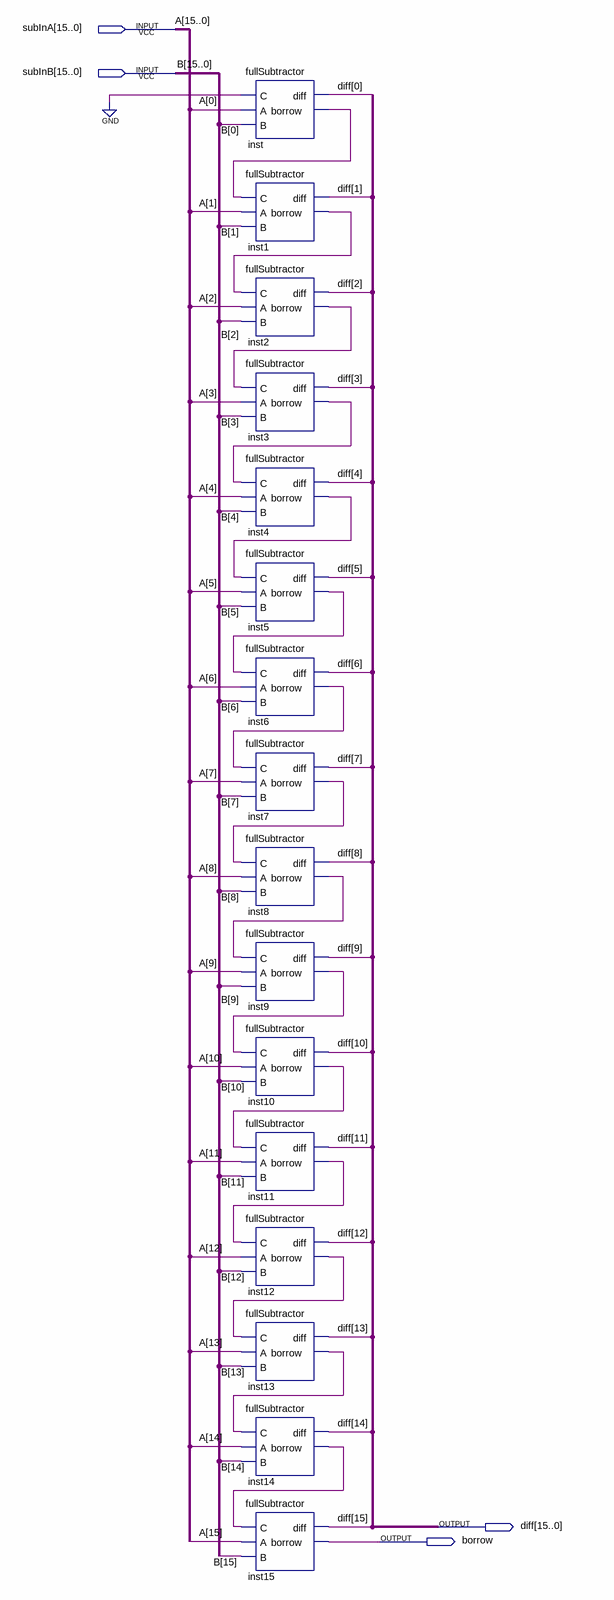
[diagram p0: schematic sheet]
// Quartus schematic sub16.bdf as structural Verilog: 16 symbols, 4 pins
module sub16 (
  input  [15:0] subInA,
  input  [15:0] subInB,
  output [15:0] diff,
  output borrow
);

  wire inst1_borrow, inst2_borrow, inst3_borrow, inst4_borrow, inst5_borrow, inst6_borrow, inst7_borrow,
       inst8_borrow, inst9_borrow, inst10_borrow, inst11_borrow, inst12_borrow, inst13_borrow, inst14_borrow,
       inst_borrow;

  fullSubtractor inst (.C(1'b0), .A(subInA[0]), .B(subInB[0]), .diff(diff[0]), .borrow(inst_borrow));
  fullSubtractor inst1 (.C(inst_borrow), .A(subInA[1]), .B(subInB[1]), .diff(diff[1]), .borrow(inst1_borrow));
  fullSubtractor inst2 (.C(inst1_borrow), .A(subInA[2]), .B(subInB[2]), .diff(diff[2]), .borrow(inst2_borrow));
  fullSubtractor inst3 (.C(inst2_borrow), .A(subInA[3]), .B(subInB[3]), .diff(diff[3]), .borrow(inst3_borrow));
  fullSubtractor inst4 (.C(inst3_borrow), .A(subInA[4]), .B(subInB[4]), .diff(diff[4]), .borrow(inst4_borrow));
  fullSubtractor inst5 (.C(inst4_borrow), .A(subInA[5]), .B(subInB[5]), .diff(diff[5]), .borrow(inst5_borrow));
  fullSubtractor inst6 (.C(inst5_borrow), .A(subInA[6]), .B(subInB[6]), .diff(diff[6]), .borrow(inst6_borrow));
  fullSubtractor inst7 (.C(inst6_borrow), .A(subInA[7]), .B(subInB[7]), .diff(diff[7]), .borrow(inst7_borrow));
  fullSubtractor inst8 (.C(inst7_borrow), .A(subInA[8]), .B(subInB[8]), .diff(diff[8]), .borrow(inst8_borrow));
  fullSubtractor inst9 (.C(inst8_borrow), .A(subInA[9]), .B(subInB[9]), .diff(diff[9]), .borrow(inst9_borrow));
  fullSubtractor inst10 (.C(inst9_borrow), .A(subInA[10]), .B(subInB[10]), .diff(diff[10]), .borrow(inst10_borrow));
  fullSubtractor inst11 (.C(inst10_borrow), .A(subInA[11]), .B(subInB[11]), .diff(diff[11]), .borrow(inst11_borrow));
  fullSubtractor inst12 (.C(inst11_borrow), .A(subInA[12]), .B(subInB[12]), .diff(diff[12]), .borrow(inst12_borrow));
  fullSubtractor inst13 (.C(inst12_borrow), .A(subInA[13]), .B(subInB[13]), .diff(diff[13]), .borrow(inst13_borrow));
  fullSubtractor inst14 (.C(inst13_borrow), .A(subInA[14]), .B(subInB[14]), .diff(diff[14]), .borrow(inst14_borrow));
  fullSubtractor inst15 (.C(inst14_borrow), .A(subInA[15]), .B(subInB[15]), .diff(diff[15]), .borrow(borrow));

  // Other names for the same wires on the sheet: A[15:0] = subInA; B[15:0] = subInB
endmodule
